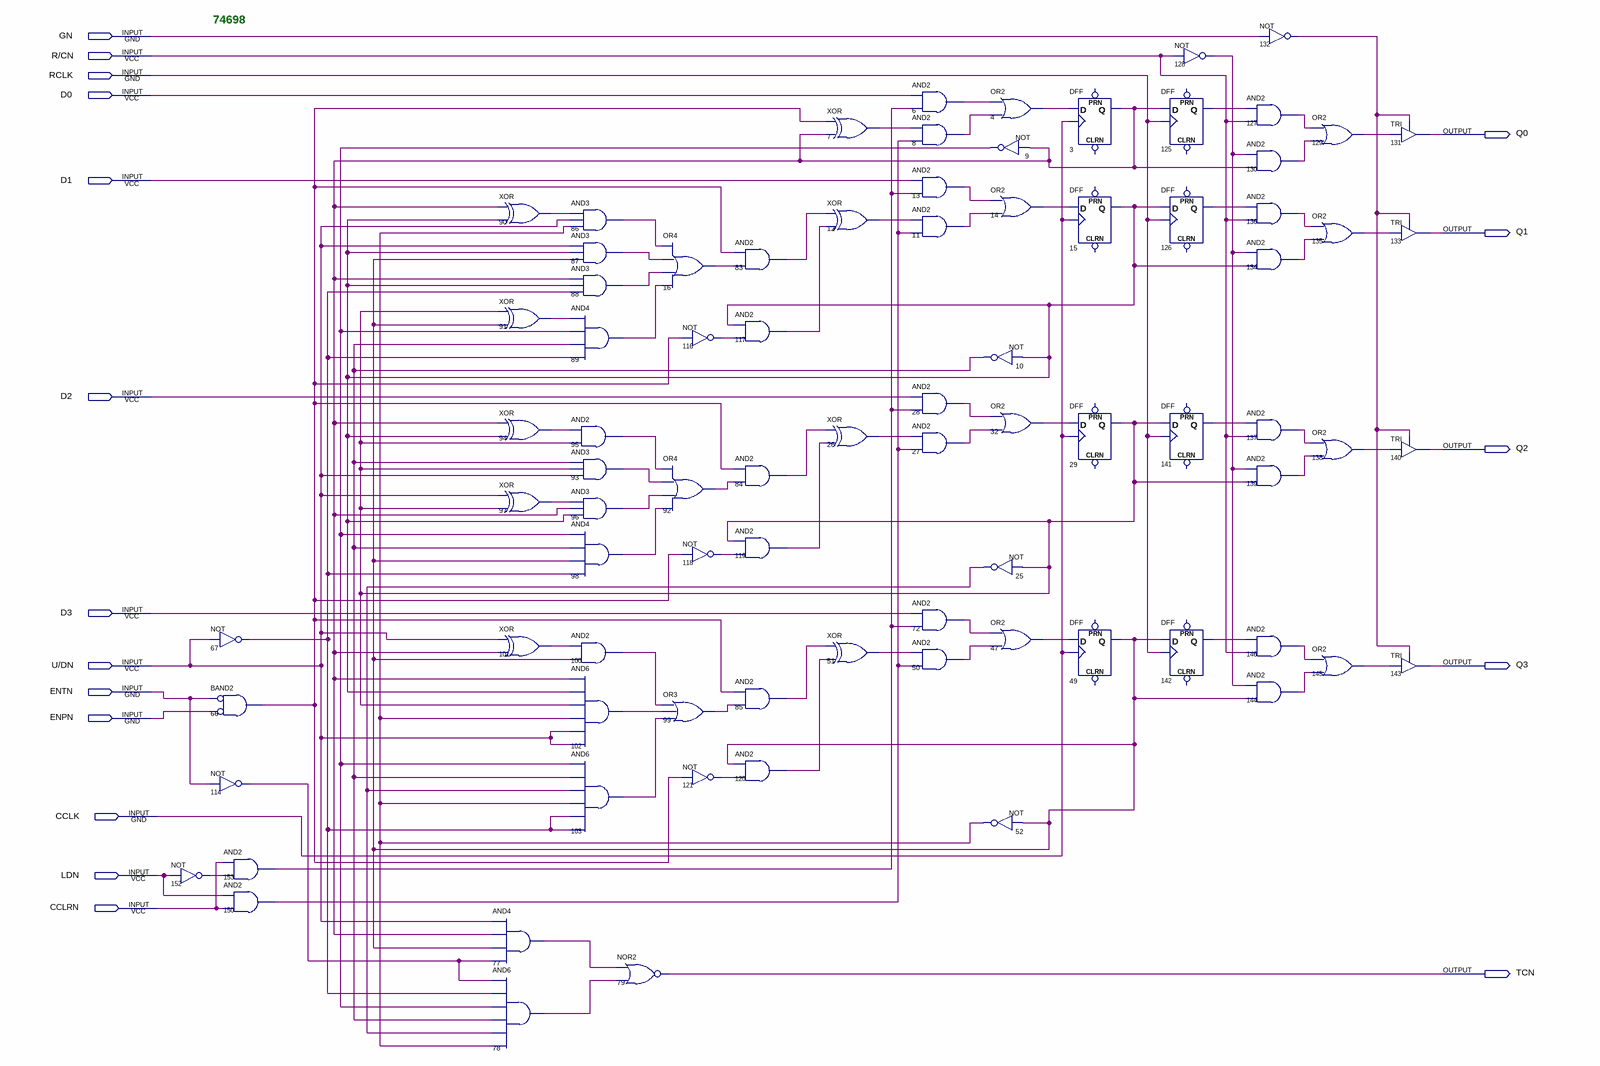
[diagram p0: schematic sheet]
// Quartus schematic 74698.bdf as structural Verilog: 83 symbols, 18 pins
module \74698  (
  input  GN,
  input  \R/CN ,
  input  RCLK,
  input  D0,
  input  D1,
  input  D2,
  input  D3,
  input  \U/DN ,
  input  ENTN,
  input  ENPN,
  input  CCLK,
  input  LDN,
  input  CCLRN,
  output Q0,
  output Q1,
  output Q2,
  output Q3,
  output TCN
);

  wire n3_q, n4_out, n6_out, n7_out, n8_out, n9_out, n10_out, n11_out, n12_out, n13_out, n14_out, n15_q,
       n16_out, n25_out, n26_out, n27_out, n28_out, n29_q, n32_out, n47_out, n49_q, n50_out, n51_out,
       n52_out, n66_out, n67_out, n72_out, n77_out, n78_out, n83_out, n84_out, n85_out, n86_out, n87_out,
       n88_out, n89_out, n90_out, n91_out, n92_out, n93_out, n94_out, n95_out, n96_out, n97_out, n98_out,
       n99_out, n100_out, n101_out, n102_out, n103_out, n114_out, n116_out, n117_out, n118_out, n119_out,
       n120_out, n121_out, n125_q, n126_q, n127_out, n128_out, n129_out, n130_out, n132_out, n134_out,
       n135_out, n136_out, n137_out, n138_out, n139_out, n141_q, n142_q, n144_out, n145_out, n146_out,
       n150_out, n152_out, n153_out;

  not u_67 (n67_out, \U/DN );
  and u_66 (n66_out, ~ENTN, ~ENPN);  // BAND2
  not u_114 (n114_out, ENTN);
  not u_152 (n152_out, LDN);
  and u_153 (n153_out, CCLRN, n152_out);
  and u_150 (n150_out, LDN, CCLRN);
  xor u_90 (n90_out, n3_q, n15_q);
  xor u_91 (n91_out, n29_q, n49_q);
  xor u_94 (n94_out, n3_q, n15_q);
  xor u_97 (n97_out, \U/DN , n29_q);
  xor u_101 (n101_out, \U/DN , n3_q);
  and u_77 (n77_out, \U/DN , n3_q, n49_q, n114_out);
  and u_78 (n78_out, n114_out, n67_out, n9_out, n10_out, n25_out, n52_out);
  and u_86 (n86_out, n90_out, \U/DN , n52_out);
  and u_87 (n87_out, \U/DN , n15_q, n49_q);
  and u_88 (n88_out, n3_q, n15_q, n67_out);
  and u_89 (n89_out, n91_out, n9_out, n10_out, n67_out);
  and u_95 (n95_out, n94_out, n29_q);
  and u_93 (n93_out, n10_out, n29_q, \U/DN );
  and u_96 (n96_out, n97_out, n3_q, n15_q);
  and u_98 (n98_out, n9_out, n10_out, n49_q, n67_out);
  and u_100 (n100_out, n101_out, n49_q);
  and u_102 (n102_out, n3_q, n15_q, n29_q, n52_out, \U/DN , \U/DN );
  and u_103 (n103_out, n9_out, n10_out, n25_out, n52_out, n67_out, n67_out);
  nor u_79 (TCN, n77_out, n78_out);
  or u_16 (n16_out, n86_out, n87_out, n88_out, n89_out);
  not u_116 (n116_out, n66_out);
  or u_92 (n92_out, n95_out, n93_out, n96_out, n98_out);
  not u_118 (n118_out, n66_out);
  or u_99 (n99_out, n100_out, n102_out, n103_out);
  not u_121 (n121_out, n66_out);
  and u_83 (n83_out, n66_out, n16_out);
  and u_117 (n117_out, n15_q, n116_out);
  and u_84 (n84_out, n66_out, n92_out);
  and u_119 (n119_out, n29_q, n118_out);
  and u_85 (n85_out, n66_out, n99_out);
  and u_120 (n120_out, n49_q, n121_out);
  xor u_7 (n7_out, n66_out, n3_q);
  xor u_12 (n12_out, n83_out, n117_out);
  xor u_26 (n26_out, n84_out, n119_out);
  xor u_51 (n51_out, n85_out, n120_out);
  and u_6 (n6_out, D0, n153_out);
  and u_8 (n8_out, n7_out, n150_out);
  and u_13 (n13_out, D1, n153_out);
  and u_11 (n11_out, n12_out, n150_out);
  and u_28 (n28_out, D2, n153_out);
  and u_27 (n27_out, n26_out, n150_out);
  and u_72 (n72_out, D3, n153_out);
  and u_50 (n50_out, n51_out, n150_out);
  or u_4 (n4_out, n6_out, n8_out);
  not u_9 (n9_out, n3_q);
  or u_14 (n14_out, n13_out, n11_out);
  not u_10 (n10_out, n15_q);
  or u_32 (n32_out, n28_out, n27_out);
  not u_25 (n25_out, n29_q);
  or u_47 (n47_out, n72_out, n50_out);
  not u_52 (n52_out, n49_q);
  DFF u_3 (.CLK(CCLK), .D(n4_out), .Q(n3_q));  // open: CLRN, PRN
  DFF u_15 (.CLK(CCLK), .D(n14_out), .Q(n15_q));  // open: CLRN, PRN
  DFF u_29 (.CLK(CCLK), .D(n32_out), .Q(n29_q));  // open: CLRN, PRN
  DFF u_49 (.CLK(CCLK), .D(n47_out), .Q(n49_q));  // open: CLRN, PRN
  not u_128 (n128_out, \R/CN );
  DFF u_125 (.CLK(RCLK), .D(n3_q), .Q(n125_q));  // open: CLRN, PRN
  DFF u_126 (.CLK(RCLK), .D(n15_q), .Q(n126_q));  // open: CLRN, PRN
  DFF u_141 (.CLK(RCLK), .D(n29_q), .Q(n141_q));  // open: CLRN, PRN
  DFF u_142 (.CLK(RCLK), .D(n49_q), .Q(n142_q));  // open: CLRN, PRN
  not u_132 (n132_out, GN);
  and u_127 (n127_out, n125_q, \R/CN );
  and u_130 (n130_out, n128_out, n3_q);
  and u_136 (n136_out, n126_q, \R/CN );
  and u_134 (n134_out, n128_out, n15_q);
  and u_137 (n137_out, n141_q, \R/CN );
  and u_139 (n139_out, n128_out, n29_q);
  and u_146 (n146_out, n142_q, \R/CN );
  and u_144 (n144_out, n128_out, n49_q);
  or u_129 (n129_out, n127_out, n130_out);
  or u_135 (n135_out, n136_out, n134_out);
  or u_138 (n138_out, n137_out, n139_out);
  or u_145 (n145_out, n146_out, n144_out);
  TRI u_131 (.IN(n129_out), .OE(n132_out), .OUT(Q0));
  TRI u_133 (.IN(n135_out), .OE(n132_out), .OUT(Q1));
  TRI u_140 (.IN(n138_out), .OE(n132_out), .OUT(Q2));
  TRI u_143 (.IN(n145_out), .OE(n132_out), .OUT(Q3));

  // Notes on the sheet:
  //   74698
endmodule
